# EasyEDA Pro project ProProject_ADS1292R-TestBoard.epro

# Schematic ADS1292R
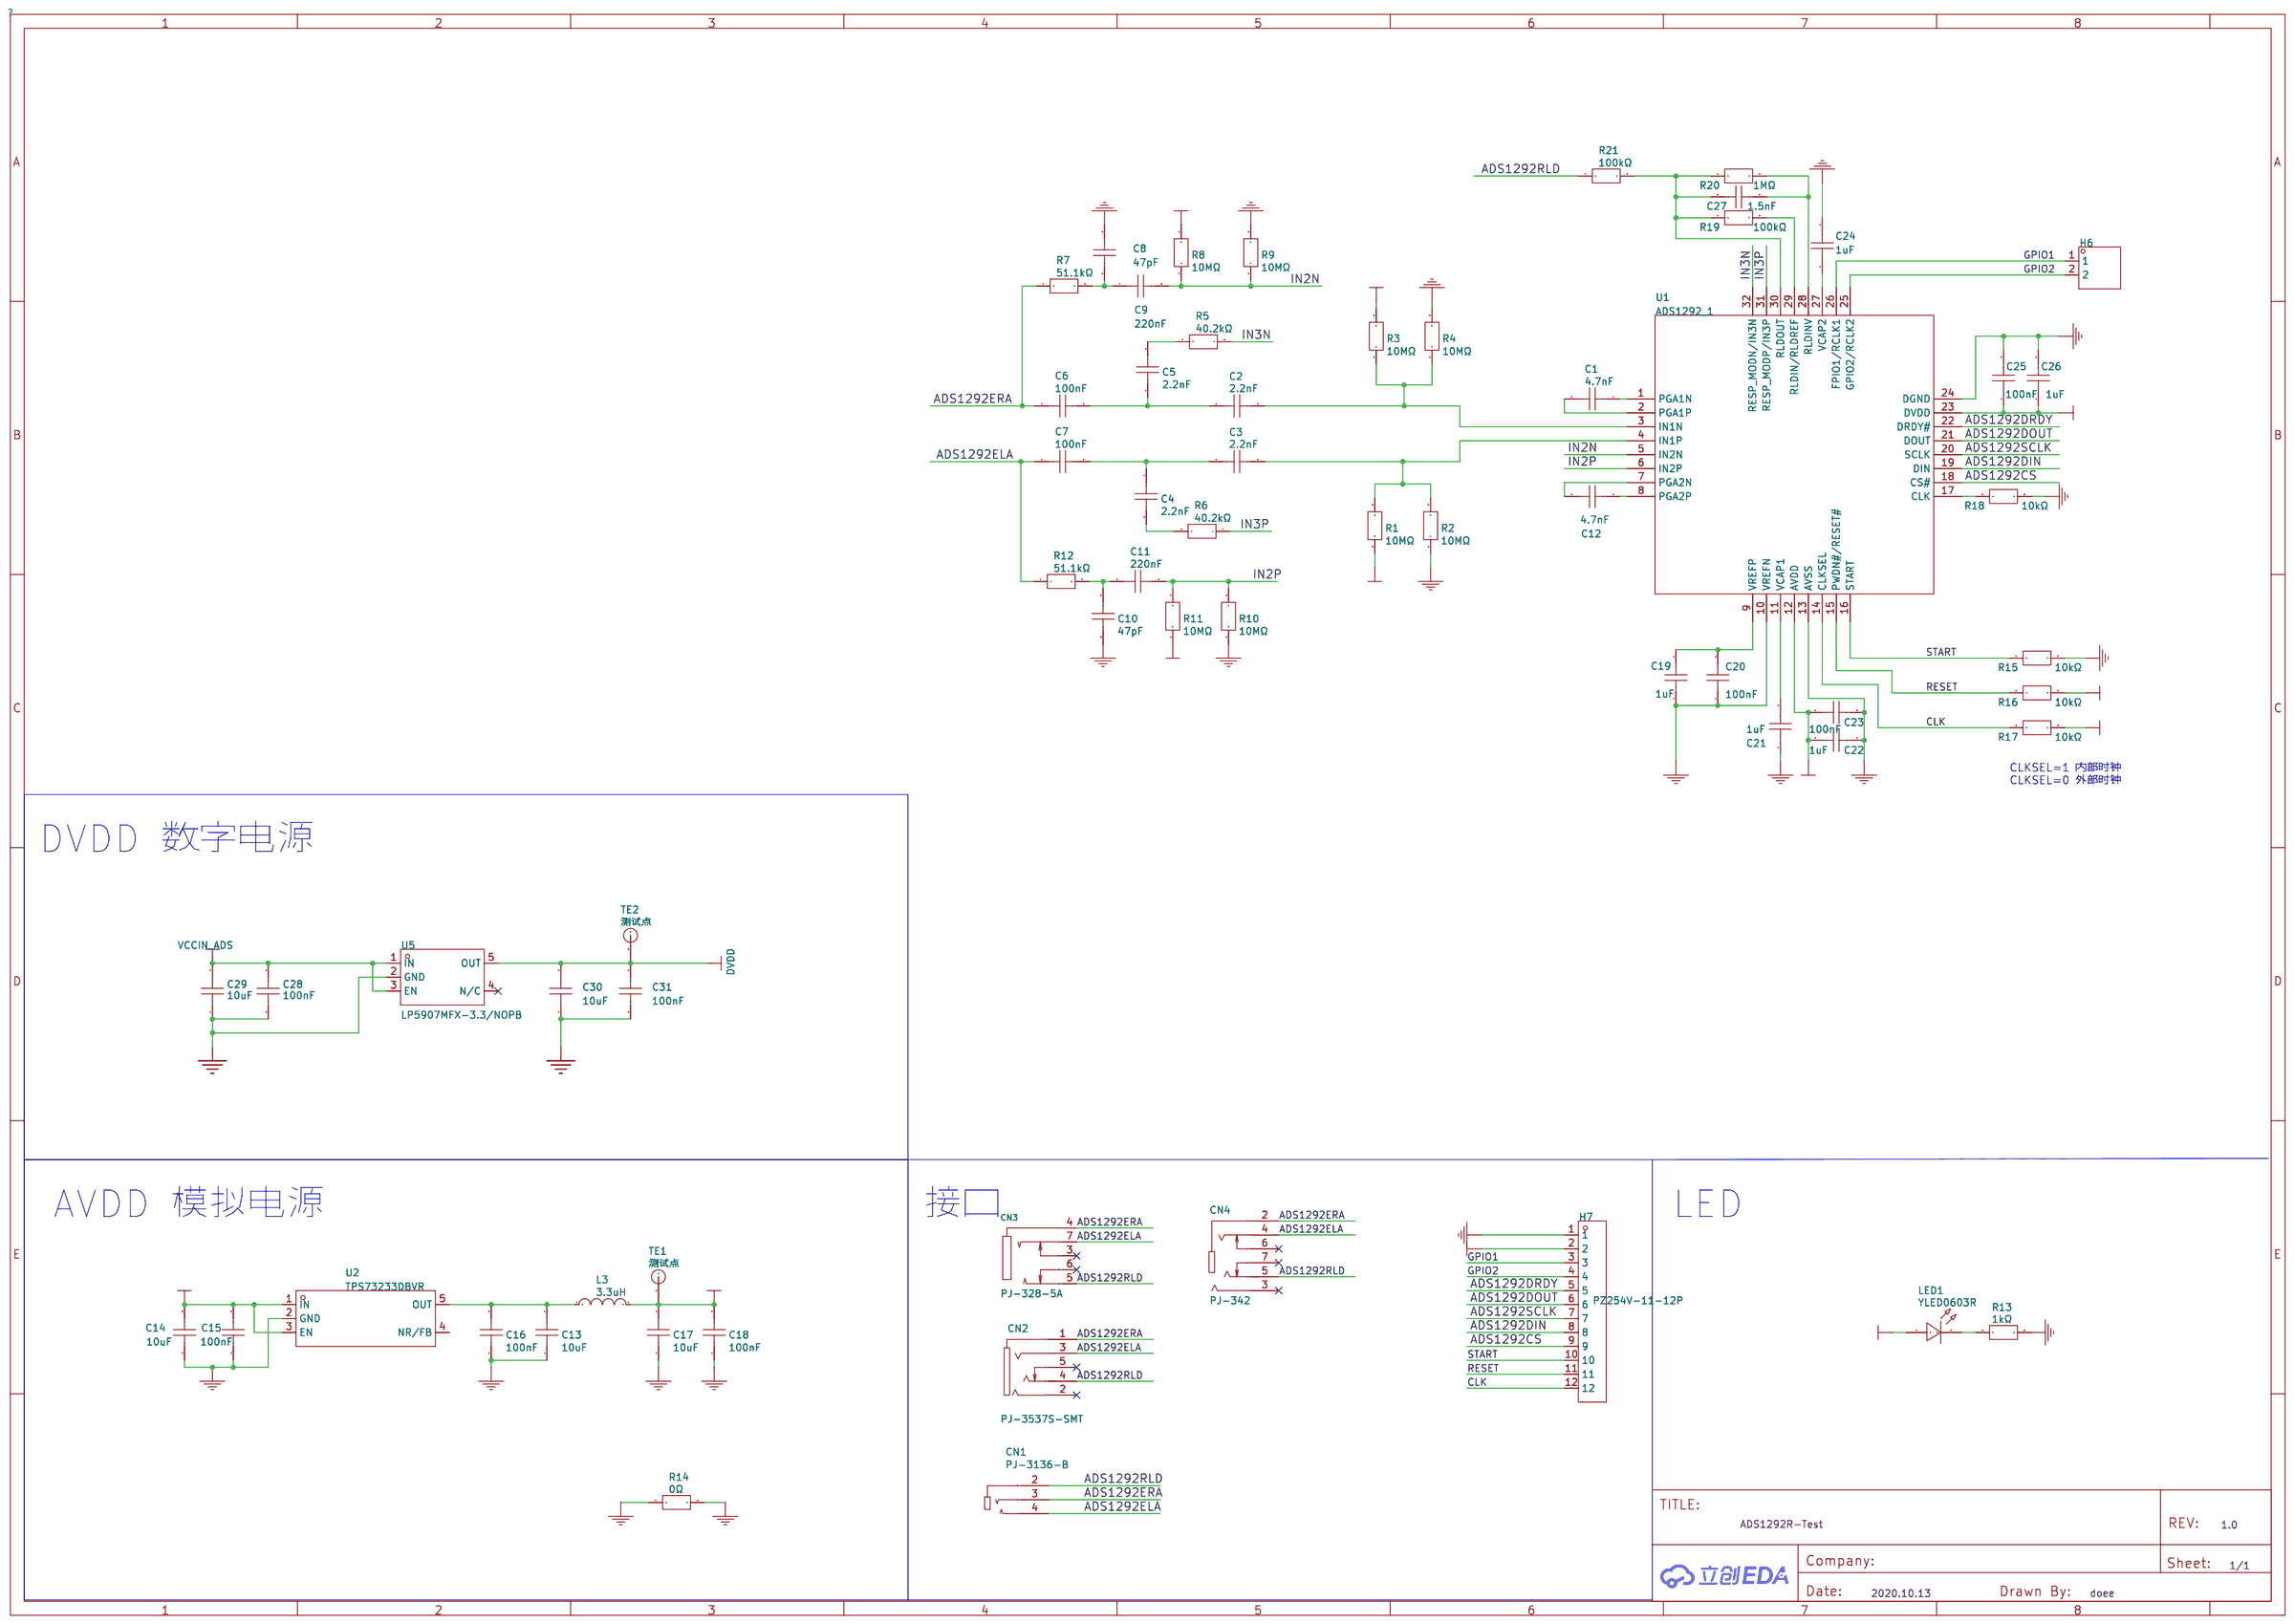
[diagram p0: schematic sheet]

## Parts
C1  4.7nF  [C0603]
C2  2.2nF  [C0603]
C3  2.2nF  [C0603]
C4  2.2nF  [C0603]
C5  2.2nF  [C0603]
C6  100nF  [C0603]
C7  100nF  [C0603]
C8  47pF  [C0603]
C9  220nF  [C0603]
C10  47pF  [C0603]
C11  220nF  [C0603]
C12  4.7nF  [C0603]
C13  10uF  [C0603]
C14  10uF  [C0603]
C15  100nF  [C0603]
C16  100nF  [C0603]
C17  10uF  [C0603]
C18  100nF  [C0603]
C19  1uF  [C0603]
C20  100nF  [C0603]
C21  1uF  [C0603]
C22  1uF  [C0603]
C23  100nF  [C0603]
C24  1uF  [C0603]
C25  100nF  [C0603]
C26  1uF  [C0603]
C27  1.5nF  [C0603]
C28  100nF  [C0603]
C29  10uF  [C0603]
C30  10uF  [C0603]
C31  100nF  [C0603]
CN1  PJ-3136-B  [AUDIO-TH_PJ-3136-B]
CN2  PJ-3537S-SMT  [AUDIO-SMD_PJ-3537S]
CN3  PJ-328-5A  [AUDIO-SMD_PJ-328-5A]
CN4  PJ-342  [AUDIO-SMD_PJ-342]
H6  -  [HDR-TH_2P-P2.54-V-M-1]
H7  PZ254V-11-12P  [HDR-TH_12P-P2.54-V-M]
L3  3.3uH  [L0805]
LED1  YLED0603R  [LED0603_RED]
R1  10MΩ  [R0603]
R2  10MΩ  [R0603]
R3  10MΩ  [R0603]
R4  10MΩ  [R0603]
R5  40.2kΩ  [R0603]
R6  40.2kΩ  [R0603]
R7  51.1kΩ  [R0603]
R8  10MΩ  [R0603]
R9  10MΩ  [R0603]
R10  10MΩ  [R0603]
R11  10MΩ  [R0603]
R12  51.1kΩ  [R0603]
R13  1kΩ  [R0603]
R14  0Ω  [R0603]
R15  10kΩ  [R0603]
R16  10kΩ  [R0603]
R17  10kΩ  [R0603]
R18  10kΩ  [R0603]
R19  100kΩ  [R0603]
R20  1MΩ  [R0603]
R21  100kΩ  [R0603]
TE1  测试点  [测试点]
TE2  测试点  [测试点]
U1  ADS1292_1  [TQFP-32_L5.0-W5.0-P0.50-LS7.0-TL]
U2  TPS73233DBVR  [SOT-23-5_L3.0-W1.7-P0.95-LS2.8-BL]
U5  LP5907MFX-3.3/NOPB  [SOT-23-5_L3.0-W1.7-P0.95-LS2.8-BR]

## Library data of the parts
C1 C12 = CC0603JRX7R9BB472: 容值:4.7nF;精度:±5%;额定电压:50V;材质(温度系数):X7R;; LCSC Part Name: 4.7nF ±5% 50V; Supplier Part: C115060; Manufacturer: YAGEO(国巨); Supplier Footprint: 0603; JLCPCB Part Class: Extended Part; Datasheet: https://atta.szlcsc.com/upload/public/pdf/source/20190902/C115060_75CC56ECD18DDC66370B1FAE6FC3B8B0.pdf; Supplier: LCSC; Tolerance: ±5%; Voltage Rated: 50V; Temperature Coefficient: X7R
C2-C5 = CC0603JRNPO9BN222: 容值:2.2nF;精度:±5%;额定电压:50V;材质(温度系数):NP0;; LCSC Part Name: 2.2nF ±5% 50V; Supplier Part: C107043; Manufacturer: YAGEO(国巨); Supplier Footprint: 0603; JLCPCB Part Class: Extended Part; Datasheet: https://atta.szlcsc.com/upload/public/pdf/source/20170914/C128857_1505359892143968080.pdf; Supplier: LCSC; Tolerance: ±5%; Voltage Rated: 50V; Temperature Coefficient: NP0
C6 C7 C15 C16 C18 C20 C23 C25 C28 C31 = CC0603KRX7R9BB104: 容值:100nF;精度:±10%;额定电压:50V;材质(温度系数):X7R;; LCSC Part Name: 100nF ±10% 50V; Supplier Part: C14663; Manufacturer: YAGEO(国巨); Supplier Footprint: 0603; JLCPCB Part Class: Basic Part; Datasheet: https://atta.szlcsc.com/upload/public/pdf/source/20180910/C282072_33301C7F631E79921B82A8DAC6BCC5B3.pdf; Supplier: LCSC; Tolerance: ±10%; Voltage Rated: 50V; Temperature Coefficient: X7R
C8 C10 = CL10C470JB8NNNC: 容值:47pF;精度:±5%;额定电压:50V;材质(温度系数):C0G;; LCSC Part Name: 47pF ±5% 50V; Supplier Part: C1671; Manufacturer: SAMSUNG(三星); Supplier Footprint: 0603; JLCPCB Part Class: Basic Part; Datasheet: https://atta.szlcsc.com/upload/public/pdf/source/20160218/1457707763339.pdf; Supplier: LCSC; Tolerance: ±5%; Voltage Rated: 50V; Temperature Coefficient: C0G
C9 C11 = CL10B224KA8NNNC: 容值:220nF;精度:±10%;额定电压:25V;材质(温度系数):X7R;; LCSC Part Name: 220nF ±10% 25V; Supplier Part: C21120; Manufacturer: SAMSUNG(三星); Supplier Footprint: 0603; JLCPCB Part Class: Basic Part; Datasheet: https://atta.szlcsc.com/upload/public/pdf/source/20160218/1457707763339.pdf; Supplier: LCSC; Tolerance: ±10%; Voltage Rated: 25V; Temperature Coefficient: X7R
C13 C14 C17 C29 C30 = CL10A106KP8NNNC: 容值:10uF;精度:±10%;额定电压:10V;材质(温度系数):X5R;; LCSC Part Name: 10uF ±10% 10V; Supplier Part: C19702; Manufacturer: SAMSUNG(三星); Supplier Footprint: 0603; JLCPCB Part Class: Basic Part; Datasheet: https://atta.szlcsc.com/upload/public/pdf/source/20160218/1457707763339.pdf; Supplier: LCSC; Tolerance: ±10%; Voltage Rated: 10V; Temperature Coefficient: X5R
C19 C21 C22 C24 C26 = CL10A105KB8NNNC: 容值:1uF;精度:±10%;额定电压:50V;材质(温度系数):X5R;; LCSC Part Name: 1uF ±10% 50V; Supplier Part: C15849; Manufacturer: SAMSUNG(三星); Supplier Footprint: 0603; JLCPCB Part Class: Basic Part; Datasheet: https://atta.szlcsc.com/upload/public/pdf/source/20160218/1457707763339.pdf; Supplier: LCSC; Tolerance: ±10%; Voltage Rated: 50V; Temperature Coefficient: X5R
C27 = 1.5nF: 容值:1.5nF;精度:±10%;额定电压:50V;材质(温度系数):-;; LCSC Part Name: 1.5nF ±10% 50V; Supplier Part: C15723; Manufacturer: SAMSUNG(三星); Supplier Footprint: 0603; JLCPCB Part Class: Extended Part; Datasheet: https://atta.szlcsc.com/upload/public/pdf/source/20160218/1457707763339.pdf; Supplier: LCSC; Tolerance: ±10%; Voltage Rated: 50V
CN1 = PJ-3136-B
CN2 = PJ-3537S-SMT: 连接器类型:3.5mm耳机座;额定电流:500mA;额定电压:30V;工作温度范围:-30℃~+70℃;焊接温度(最大值):235℃;; LCSC Part Name: 3.5mm耳机座; Supplier Part: C2689709; Manufacturer: XKB Connectivity(中国星坤); Supplier Footprint: SMD; JLCPCB Part Class: 扩展库; Datasheet: https://atta.szlcsc.com/upload/public/pdf/source/20211011/4D65D926E465F62F21B1233CD02CC06B.pdf; Supplier: LCSC; Connector Type: 3.5mm耳机座; Current Rating (Max): 500mA; Voltage Rating (Max): 30V; Operating Temperature Range: -30℃~+70℃; Soldering Temperature(Max): 235℃
CN3 = PJ-328-5A: 连接器类型:3.5mm耳机座;额定电流:500mA;额定电压:30V;工作温度范围:-20℃~+70℃;; LCSC Part Name: 3.5mm耳机座; Supplier Part: C707231; Manufacturer: 韩国韩荣; Supplier Footprint: SMD; Datasheet: https://atta.szlcsc.com/upload/public/pdf/source/20210810/0B771907E8D6964D4FE913522096DF4A.pdf; Supplier: LCSC; Connector Type: 3.5mm耳机座; Current Rating (Max): 500mA; Voltage Rating (Max): 30V; Operating Temperature Range: -20℃~+70℃
CN4 = PJ-342_C668606: 连接器类型:3.5mm耳机座;额定电流:500mA;额定电压:30V;工作温度范围:-30℃~+70℃;; LCSC Part Name: 3.5mm耳机座; Supplier Part: C668606; Manufacturer: SHOU HAN(首韩); Supplier Footprint: SMD; Datasheet: https://atta.szlcsc.com/upload/public/pdf/source/20200618/C668606_D9051A7D9D1D8CCDEAA76A8E7BC279ED.pdf; Supplier: LCSC; Connector Type: 3.5mm耳机座; Current Rating (Max): 500mA; Voltage Rating (Max): 30V; Operating Temperature Range: -30℃~+70℃
H6 = HDR-M_2.54_1x2P: Supplier Part: C124375; Supplier Footprint: 插件; JLCPCB Part Class: 扩展库
H7 = PZ254V-11-12P: 插针结构:1x12P;间距:2.54mm;行距:-;圆针/方针:方针;安装类型:直插;排数:单排;总PIN位数:12P;额定电流:3A;额定电压:250V;配合针长度:6mm;塑高:2.5mm;端接针长度:3mm;触头材质:-;工作温度范围:-40℃~+105℃;颜色:黑色;; LCSC Part Name: 间距:2.54mm 1x12P 直插 方针; Supplier Part: C2840012; Manufacturer: XFCN(兴飞); Supplier Footprint: 插件,P=2.54mm; JLCPCB Part Class: Extended Part; Datasheet: https://atta.szlcsc.com/upload/public/pdf/source/20200309/C492403_F9F19131791D08044AD4F84F8E751A34.pdf; Supplier: LCSC; Pin Structure: 1x12P; Pitch: 2.54mm; Circluar Pins/Square Pins: 方针; Mounting Type: 直插; Number of Rows: 单排; Number of Pins: 12P; Current Rating (Max): 3A; Voltage Rating (Max): 250V; Length of Mating Pin: 6mm; Insulation Height: 2.5mm; Length of End Connection Pin: 3mm; Operating Temperature Range: -40℃~+105℃; Color: 黑色
L3 = 3.3uH
LED1 = YLED0603R: 发光颜色:红色;正向电压(VF):1.8V~2.4V;功率:-;正向电流:25mA;主波长:620nm~625nm;二极管配置:-;透镜颜色:-;色温:-;发光强度:-;发光角度:-;载带方式:-;工作温度:-40℃~+85℃;; Supplier Part: C19171390; Manufacturer: YONGYUTAI(永裕泰); Supplier Footprint: 0603; JLCPCB Part Class: Extended Part; Datasheet: https://atta.szlcsc.com/upload/public/pdf/source/20231027/FB19AF06E2C70028E58AB5CEDD1BDC72.pdf; Supplier: LCSC; Emitted Color: 红色; Forward Voltage (VF): 1.8V~2.4V; Forward Current: 25mA; Dominant Wavelength: 620nm~625nm; Operating Temperature: -40℃~+85℃
R1-R4 R8-R11 = 0603WAF1005T5E: 电阻类型:厚膜电阻;阻值:10MΩ;精度:±1%;功率:100mW;最大工作电压:75V;温度系数:±100ppm/℃;; LCSC Part Name: 10MΩ ±1% 100mW 厚膜电阻; Supplier Part: C7250; Manufacturer: UNI-ROYAL(厚声); Supplier Footprint: 0603; JLCPCB Part Class: Basic Part; Datasheet: https://atta.szlcsc.com/upload/public/pdf/source/20200306/C422600_1E6D84923E4A46A82E41ADD87F860B5C.pdf; Supplier: LCSC; Type: 厚膜电阻; Tolerance: ±1%; Power(Watts): 100mW; Overload Voltage (Max): 75V; Temperature Coefficient: ±100ppm/℃; Operating Temperature Range: -55℃~+155℃
R5 R6 = 0603WAF4022T5E: 电阻类型:厚膜电阻;阻值:40.2kΩ;精度:±1%;功率:100mW;最大工作电压:75V;温度系数:±100ppm/℃;; LCSC Part Name: 40.2kΩ ±1% 100mW 厚膜电阻; Supplier Part: C12447; Manufacturer: UNI-ROYAL(厚声); Supplier Footprint: 0603; JLCPCB Part Class: Extended Part; Datasheet: https://atta.szlcsc.com/upload/public/pdf/source/20200306/C422600_1E6D84923E4A46A82E41ADD87F860B5C.pdf; Supplier: LCSC; Type: 厚膜电阻; Tolerance: ±1%; Power(Watts): 100mW; Overload Voltage (Max): 75V; Temperature Coefficient: ±100ppm/℃; Operating Temperature Range: -55℃~+155℃
R7 R12 = 0603WAF5112T5E: 电阻类型:厚膜电阻;阻值:51.1kΩ;精度:±1%;功率:100mW;最大工作电压:75V;温度系数:±100ppm/℃;; LCSC Part Name: 51.1kΩ ±1% 100mW 厚膜电阻; Supplier Part: C23072; Manufacturer: UNI-ROYAL(厚声); Supplier Footprint: 0603; JLCPCB Part Class: Extended Part; Datasheet: https://atta.szlcsc.com/upload/public/pdf/source/20200306/C422600_1E6D84923E4A46A82E41ADD87F860B5C.pdf; Supplier: LCSC; Type: 厚膜电阻; Tolerance: ±1%; Power(Watts): 100mW; Overload Voltage (Max): 75V; Temperature Coefficient: ±100ppm/℃; Operating Temperature Range: -55℃~+155℃
R13 = RC0603FR-071KL: 电阻类型:厚膜电阻;阻值:1kΩ;精度:±1%;功率:100mW;最大工作电压:75V;温度系数:±100ppm/℃;; LCSC Part Name: 厚膜电阻 1kΩ ±1% 100mW; Supplier Part: C22548; Manufacturer: YAGEO(国巨); Supplier Footprint: 0603; JLCPCB Part Class: Extended Part; Datasheet: https://atta.szlcsc.com/upload/public/pdf/source/20180316/70C0E2BDAE7FCC62C531A5A58D202EE1.pdf; Supplier: LCSC; Type: 厚膜电阻; Tolerance: ±1%; Power(Watts): 100mW; Overload Voltage (Max): 75V; Temperature Coefficient: ±100ppm/℃; Operating Temperature Range: -55℃~+155℃
R14 = 0603WAF0000T5E: 电阻类型:厚膜电阻;阻值:0Ω;精度:±1%;功率:100mW;最大工作电压:75V;; LCSC Part Name: 0Ω ±1% 100mW 厚膜电阻; Supplier Part: C21189; Manufacturer: UNI-ROYAL(厚声); Supplier Footprint: 0603; JLCPCB Part Class: Basic Part; Datasheet: https://atta.szlcsc.com/upload/public/pdf/source/20200306/C422600_1E6D84923E4A46A82E41ADD87F860B5C.pdf; Supplier: LCSC; Type: 厚膜电阻; Tolerance: ±1%; Power(Watts): 100mW; Overload Voltage (Max): 75V; Operating Temperature Range: -55℃~+155℃
R15-R18 = 0603WAF1002T5E: 电阻类型:厚膜电阻;阻值:10kΩ;精度:±1%;功率:100mW;最大工作电压:75V;温度系数:±100ppm/℃;; LCSC Part Name: 厚膜电阻 10kΩ ±1% 100mW; Supplier Part: C25804; Manufacturer: UNI-ROYAL(厚声); Supplier Footprint: 0603; JLCPCB Part Class: Basic Part; Datasheet: https://atta.szlcsc.com/upload/public/pdf/source/20200306/C422600_1E6D84923E4A46A82E41ADD87F860B5C.pdf; Supplier: LCSC; Type: 厚膜电阻; Tolerance: ±1%; Power(Watts): 100mW; Overload Voltage (Max): 75V; Temperature Coefficient: ±100ppm/℃; Operating Temperature Range: -55℃~+155℃
R19 R21 = RC0603FR-07100KL: 电阻类型:厚膜电阻;阻值:100kΩ;精度:±1%;功率:100mW;最大工作电压:75V;温度系数:±100ppm/℃;; LCSC Part Name: 厚膜电阻 100kΩ ±1% 100mW; Supplier Part: C14675; Manufacturer: YAGEO(国巨); Supplier Footprint: 0603; JLCPCB Part Class: Extended Part; Datasheet: https://atta.szlcsc.com/upload/public/pdf/source/20140324/1457707028752.pdf; Supplier: LCSC; Type: 厚膜电阻; Tolerance: ±1%; Power(Watts): 100mW; Overload Voltage (Max): 75V; Temperature Coefficient: ±100ppm/℃; Operating Temperature Range: -55℃~+155℃
R20 = 0603WAF1004T5E: 电阻类型:厚膜电阻;阻值:1MΩ;精度:±1%;功率:100mW;最大工作电压:75V;温度系数:±100ppm/℃;; LCSC Part Name: 1MΩ ±1% 100mW 厚膜电阻; Supplier Part: C22935; Manufacturer: UNI-ROYAL(厚声); Supplier Footprint: 0603; JLCPCB Part Class: Basic Part; Datasheet: https://atta.szlcsc.com/upload/public/pdf/source/20200306/C422600_1E6D84923E4A46A82E41ADD87F860B5C.pdf; Supplier: LCSC; Type: 厚膜电阻; Tolerance: ±1%; Power(Watts): 100mW; Overload Voltage (Max): 75V; Temperature Coefficient: ±100ppm/℃; Operating Temperature Range: -55℃~+155℃
TE1 TE2 = 测试点
U1 = ADS1292_1
U2 = TPS73233DBVR: 输出类型:固定;最大输入电压:5.5V;输出电压:3.3V;最大输出电流:250mA;电源纹波抑制比(PSRR):58dB;输出极性:正极;; LCSC Part Name: 输入5.5V 输出3.3V 250mA; Supplier Part: C181459; Manufacturer: TI(德州仪器); Supplier Footprint: SOT-23-5; JLCPCB Part Class: Extended Part; Datasheet: https://www.ti.com/cn/lit/gpn/tps732; Supplier: LCSC; Output Type: 固定; Maximum Input Voltage: 5.5V; Output Voltage: 3.3V; MAX Output Current: 250mA; Power Supply Rejection Ratio (PSRR): 58dB; Dropout Voltage: 150mV@(250mA); standby current: 550uA; Operating Temperature: -40℃~+125℃; Output Polarity: 正极; Number of Outputs: 1
U5 = LP5907MFX-3.3/NOPB: 输出类型:固定;最大输入电压:5.5V;输出电压:3.3V;最大输出电流:250mA;电源纹波抑制比(PSRR):90dB;输出极性:正极;; LCSC Part Name: 输入5.5V 输出3.3V 250mA; Supplier Part: C80670; Manufacturer: TI(德州仪器); Supplier Footprint: SOT-23-5; JLCPCB Part Class: 扩展库; Datasheet: https://www.ti.com/cn/lit/gpn/lp5907; Supplier: LCSC; Output Type: 固定; Maximum Input Voltage: 5.5V; Output Voltage: 3.3V; MAX Output Current: 250mA; Power Supply Rejection Ratio (PSRR): 90dB; Dropout Voltage: 250mV@(250mA); standby current: 25uA; Operating Temperature: -40℃~+125℃; Output Polarity: 正极; Number of Outputs: 1

## Nets
AVDD: C17.2 C18.2 C22.2 C23.2 L3.2 R1.1 R3.2 R8.2 R11.2 TE1.1 U1.12(AVDD)
AVSS: C8.2 C10.2 C18.1 C19.1 C20.1 C22.1 C23.1 R2.1 R4.2 R9.2 R10.2 R14.1 U1.10(VREFN) U1.13(AVSS)
DVDD: C25.1 C26.1 C30.2 C31.2 LED1.1 R16.2 R17.2 TE2.1 U1.23(DVDD) U5.5(OUT)
GND: C13.1 C14.1 C15.1 C16.1 C17.1 C21.1 C24.1 C25.2 C26.2 C28.1 C29.1 C30.1 C31.1 H7.1 R13.2 R14.2 R15.2 R18.2 U1.24(DGND) U2.2(GND) U5.2(GND)
VCCIN_ADS: C14.2 C15.2 C28.2 C29.2 H7.2 U2.1(IN) U2.3(EN) U5.1(IN) U5.3(EN)
ADS1292CS: H7.9 U1.18(CS#)
ADS1292DIN: H7.8 U1.19(DIN)
ADS1292DOUT: H7.6 U1.21(DOUT)
ADS1292DRDY: H7.5 U1.22(DRDY#)
ADS1292ELA: C7.1 CN1.4 CN2.3 CN3.7 CN4.4 R12.1
ADS1292ERA: C6.1 CN1.3 CN2.1 CN3.4 CN4.2 R7.1
ADS1292RLD: CN1.2 CN2.4 CN3.5 CN4.5 R21.1
ADS1292SCLK: H7.7 U1.20(SCLK)
CLK: H7.12 R17.1 U1.14(CLKSEL)
GPIO1: H6.1 H7.3 U1.26(FPIO1/RCLK1)
GPIO2: H6.2 H7.4 U1.25(GPIO2/RCLK2)
IN2N: C9.2 R8.1 R9.1 U1.5(IN2N)
IN2P: C11.2 R10.1 R11.1 U1.6(IN2P)
IN3N: R5.2 U1.32(RESP_MODN/IN3N)
IN3P: R6.1 U1.31(RESP_MODP/IN3P)
RESET: H7.11 R16.1 U1.15(PWDN#/RESET#)
START: H7.10 R15.1 U1.16(START)
$1N1: C1.1 U1.1(PGA1N)
$1N2: C1.2 U1.2(PGA1P)
$1N10: C4.2 R6.2
$1N11: C5.2 R5.1
$1N15: C8.1 C9.1 R7.2
$1N18: C10.1 C11.1 R12.2
$1N28: C12.1 U1.8(PGA2P)
$1N29: C12.2 U1.7(PGA2N)
$1N32: C13.2 C16.2 L3.1 U2.5(OUT)
$1N33: LED1.2 R13.1
$1N42: C19.2 C20.2 U1.9(VREFP)
$1N44: C21.2 U1.11(VCAP1)
$1N51: C24.2 U1.27(VCAP2)
$1N60: R18.1 U1.17(CLK)
$1N67: C27.1 R19.1 R20.1 R21.2 U1.30(RLDOUT)
$1N68: R19.2 U1.29(RLDIN/RLDREF)
$1N69: C27.2 R20.2 U1.28(RLDINV)
$1N6683: C2.1 C5.1 C6.2
$1N6699: C3.1 C4.1 C7.2
$1N6706: C3.2 R1.2 R2.2 U1.4(IN1P)
$1N6736: C2.2 R3.1 R4.1 U1.3(IN1N)

Not connected (* = marked no-connect by the designer): CN2 2* 5*; CN3 3* 6*; CN4 3* 6* 7*; U2 4(NR/FB); U5 4(N/C)*

## Notes on the sheet
- CLKSEL=1 内部时钟
  CLKSEL=0 外部时钟
- DVDD 数字电源
- AVDD 模拟电源
- 接口
- LED

# Board PCB
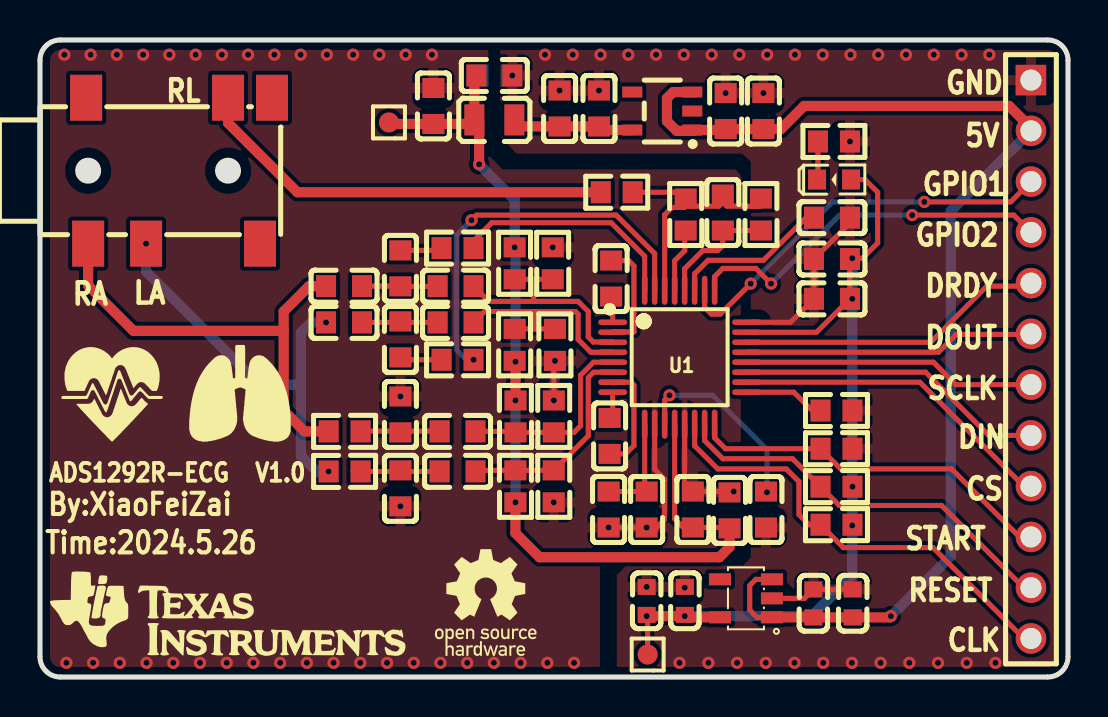
[diagram p1: board, top side]
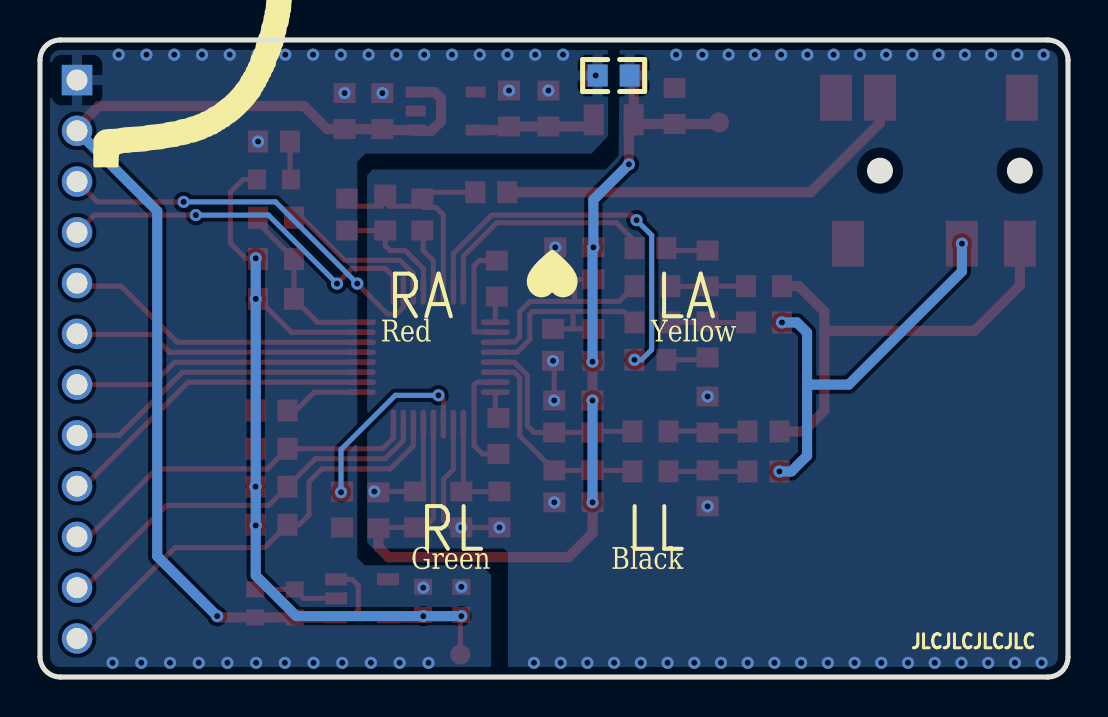
[diagram p2: board, bottom side, seen from below]

Outline 51.43 x 31.88 mm; copper layers: Top Layer, Bottom Layer. Coordinates in mm from the lower left corner of the outline.
Outline path: 0,30.86 0,1.02 arc(0.3,0.3) 1.02,0 50.42,0 arc(51.14,0.3) 51.43,1.02 51.43,30.86 arc(51.14,31.58) 50.42,31.88 1.02,31.88 arc(0.3,31.58) 0,30.86
Stack: Top Layer 0.035mm / Dielectric1 1.51mm FR4 er 4.5 / Bottom Layer 0.035mm

## Design rules (mm)
template: JLCPCB Capability(Two Layers Board)
spacing copperThickness1oz (default): track to track 0.102, other pairs 0.152 to 0.3
spacing copperThickness2oz: track to track 0.203, other pairs 0.152 to 0.3
track width copperThickness1oz (default): min 0.127, default 0.254, max 2.54
track width copperThickness2oz: min 0.203, default 0.254, max 2.54
differential pair differentialPair (default): width min 0.127, default 0.254, max 2.54; gap min 0.152, default 0.152
via viaSize (default): diameter min 0.5, default 0.61, max 10; hole min 0.3, default 0.305, max 6.3

## Placement (name value [footprint] x y rotation side)
C1  4.7nF  [C0603#2]  28.58 19.94 90 top
C2  2.2nF  [C0603#2]  20.79 19.56 0 top
C3  2.2nF  [C0603#2]  20.79 17.74 0 top
C4  2.2nF  [C0603#2]  18.03 16.89 270 top
C5  2.2nF  [C0603#2]  18.03 20.45 90 top
C6  100nF  [C0603#2]  15.21 19.56 0 top
C7  100nF  [C0603#2]  15.21 17.74 0 top
C8  47pF  [C0603#2]  18.03 13.14 90 top
C9  220nF  [C0603#2]  20.89 12.29 0 top
C10  47pF  [C0603#2]  18.03 9.44 270 top
C11  220nF  [C0603#2]  20.89 10.29 0 top
C12  4.7nF  [C0603#2]  28.5 12.07 270 top
C13  10uF  [C0603#2]  27.97 28.45 270 top
C14  10uF  [C0603#2]  34.3 28.32 270 top
C15  100nF  [C0603#2]  36.2 28.32 270 top
C16  100nF  [C0603#2]  26 28.45 270 top
C17  10uF  [C0603#2]  22.73 30.1 180 top
C18  100nF  [C0603#2]  19.68 28.57 270 top
C19  1uF  [C0603#2]  30.35 8.38 90 top
C20  100nF  [C0603#2]  28.45 8.38 90 top
C21  1uF  [C0603#2]  36.32 8.38 90 top
C22  1uF  [C0603#2]  34.5 8.34 270 top
C23  100nF  [C0603#2]  32.66 8.38 270 top
C24  1uF  [C0603#2]  39.62 22.99 180 top
C25  100nF  [C0603#2]  39.62 18.92 180 top
C26  1uF  [C0603#2]  39.62 20.92 180 top
C27  1.5nF  [C0603#2]  34.16 23.24 270 top
C28  100nF  [C0603]  38.69 3.68 270 top
C29  10uF  [C0603]  40.66 3.68 270 top
C30  10uF  [C0603]  32.27 3.81 270 top
C31  100nF  [C0603]  30.35 3.81 270 top
CN4  PJ-342  [AUDIO-SMD_PJ-342]  6.96 25.34 90 top
H7  PZ254V-11-12P  [HDR-TH_12P-P2.54-V-M]  49.58 15.9 270 top
L3  3.3uH  [L0805]  22.73 27.88 180 top
LED1  YLED0603R  [LED0603_RED]  39.73 24.89 180 top
R1  10MΩ  [R0603]  23.75 16.62 90 top
R2  10MΩ  [R0603]  25.76 16.62 90 top
R3  10MΩ  [R0603]  23.75 20.7 90 top
R4  10MΩ  [R0603]  25.65 20.7 90 top
R5  40.2kΩ  [R0603]  20.89 21.46 0 top
R6  40.2kΩ  [R0603]  20.89 15.88 180 top
R7  51.1kΩ  [R0603]  15.24 12.29 0 top
R8  10MΩ  [R0603]  23.79 13.04 90 top
R9  10MΩ  [R0603]  25.71 13.04 90 top
R10  10MΩ  [R0603]  25.7 9.54 270 top
R11  10MΩ  [R0603]  23.79 9.54 270 top
R12  51.1kΩ  [R0603]  15.24 10.29 0 top
R13  1kΩ  [R0603]  39.72 26.8 0 top
R14  0Ω  [R0603]  22.73 30.1 0 bottom
R15  10kΩ  [R0603]  39.85 11.42 0 top
R16  10kΩ  [R0603]  39.85 9.53 0 top
R17  10kΩ  [R0603]  39.85 7.62 0 top
R18  10kΩ  [R0603]  39.85 13.34 0 top
R19  100kΩ  [R0603]  32.3 23.14 270 top
R20  1MΩ  [R0603]  36.07 23.14 270 top
R21  100kΩ  [R0603]  28.86 24.26 0 top
TE1  -  [测试点]  18.16 27.75 0 top
TE2  -  [测试点]  31.1 1.13 0 top
U1  ADS1292_1  [TQFP-32_L5.0-W5.0-P0.50-LS7.0-TL]  32 16 0 top
U2  TPS73233DBVR  [SOT-23-5_L3.0-W1.7-P0.95-LS2.8-BL]  31.13 28.32 90 top
U5  LP5907MFX-3.3/NOPB  [SOT-23-5_L3.0-W1.7-P0.95-LS2.8-BR]  35.32 3.94 0 top

## Footprints (pads in the part's own frame, mm; a bottom-side part is the same pattern mirrored in y, then rotated)
AUDIO-SMD_PJ-342
  rect 2.3x1.6 smd: 2(-3.65,4.55) 3(3.65,4.65) 4(-3.65,1.65) 5(3.65,-2.45) 6(-3.65,-4.05) 7(3.65,-4.65)
C0603
  rect 0.8x0.9 smd: 1(-0.7,0) 2(0.7,0)
C0603#2
  rect 1x1.1 smd: 1(-0.9,0) 2(0.9,0)
HDR-TH_12P-P2.54-V-M
  rect 1.524x1.524 hole 1.05: 1(-13.97,0)
  round 1.524 hole 1.05: 2(-11.43,0) 3(-8.89,0) 4(-6.35,0) 5(-3.81,0) 6(-1.27,0) 7(1.27,0) 8(3.81,0) 9(6.35,0) 10(8.89,0) 11(11.43,0) 12(13.97,0)
L0805
  rect 1x1.55 smd: 1(-1,0) 2(1,0)
LED0603_RED
  rect 0.9x1 smd: 1(-0.85,0) 2(0.85,0)
R0603
  rect 1x1.1 smd: 1(-0.8,0) 2(0.8,0)
SOT-23-5_L3.0-W1.7-P0.95-LS2.8-BL
  rect 0.55x1 smd: 1(-0.95,-1.5) 2(0,-1.5) 3(0.95,-1.5) 4(0.95,1.5) 5(-0.95,1.5)
SOT-23-5_L3.0-W1.7-P0.95-LS2.8-BR
  rect 1.1x0.6 smd: 1(1.3,-0.95) 2(1.3,0) 3(1.3,0.95) 4(-1.3,0.95) 5(-1.3,-0.95)
TQFP-32_L5.0-W5.0-P0.50-LS7.0-TL
  oval 1.45x0.28 smd: 1(-3.35,1.75) 2(-3.35,1.25) 3(-3.35,0.75) 4(-3.35,0.25) 5(-3.35,-0.25) 6(-3.35,-0.75) 7(-3.35,-1.25) 8(-3.35,-1.75) 17(3.35,-1.75) 18(3.35,-1.25) 19(3.35,-0.75) 20(3.35,-0.25) 21(3.35,0.25) 22(3.35,0.75) 23(3.35,1.25) 24(3.35,1.75)
  oval 0.28x1.45 smd: 9(-1.75,-3.35) 10(-1.25,-3.35) 11(-0.75,-3.35) 12(-0.25,-3.35) 13(0.25,-3.35) 14(0.75,-3.35) 15(1.25,-3.35) 16(1.75,-3.35) 25(1.75,3.35) 26(1.25,3.35) 27(0.75,3.35) 28(0.25,3.35) 29(-0.25,3.35) 30(-0.75,3.35) 31(-1.25,3.35) 32(-1.75,3.35)
测试点
  round 1 smd: 1(-0.7,0)

## Nets
As in the schematic.

Pads without a net: CN4 3 6 7; U2 4; U5 4

## Via types
v1: diameter 0.61, hole 0.305, Top Layer to Bottom Layer, 104 vias

## Routing (per net, layer and track width the routed paths; a pad name or vN(x,y) marks a point on that pad's centre or on a via; arc(x,y) is an arc through that point)
AVDD: length 48.4
  Top Layer w0.254: U1.12 31.75,7.92 32.19,7.48 C23.2 34.45,7.48 C22.2 ; v1(23.79,15.78) R1.1
  Top Layer w0.508: v1(23.79,8.74) 23.79,7.2 24.99,5.99 33.99,5.99 34.5,6.5 C22.2 ; 21.84,27.69 21.73,27.8 L3.2 ; L3.2 21.53,27.67 C18.2 17.54,27.67 TE1.1 ; L3.2 21.73,30 C17.2 ; v1(23.79,13.84) v1(23.79,15.78) ; 21.97,27.81 v1(21.97,25.65)
  Bottom Layer w0.508: v1(23.79,15.78) 23.79,21.46 v1(23.75,21.5) 23.75,23.88 v1(21.97,25.65) ; v1(23.79,13.84) 23.79,8.75 v1(23.79,8.74)
AVSS: length 15.6
  Top Layer w0.254: v1(25.71,13.84) 25.71,15.76 v1(25.76,15.82) ; 34.75,9.24 v1(34.71,9.28) 32.64,9.28 32.25,9.67 U1.13 ; v1(28.45,7.48) v1(30.35,7.48) 30.85,7.48 31.24,7.87 31.24,9.91 30.75,10.39 U1.10
  vias: v1(1.22,31.14) v1(1.32,0.71) v1(2.53,31.14) v1(2.66,0.71) v1(3.85,31.14) v1(3.99,0.71) v1(5.16,31.14) v1(5.33,0.71) v1(6.47,31.14) v1(6.67,0.71) v1(7.79,31.14) v1(8,0.71) v1(9.1,31.14) v1(9.34,0.71) v1(10.41,31.14) v1(10.68,0.71) v1(11.73,31.14) v1(12.02,0.71) v1(13.04,31.14) v1(13.35,0.71) v1(14.35,31.14) v1(14.69,0.71) v1(15.67,31.14) v1(16.03,0.71) v1(16.98,31.14) v1(17.36,0.71) v1(18.03,14.04) v1(18.03,8.54) v1(18.3,31.14) v1(18.7,0.71) v1(19.61,31.14) v1(20.04,0.71) v1(21.37,0.71) v1(22.71,0.71) v1(24.05,0.71) v1(25.38,0.71) v1(25.65,21.5) v1(25.7,8.74) v1(26.72,0.71)
DVDD: length 46.3
  Top Layer w0.254: C26.1 C25.1 38.85,17.25 U1.23 ; C31.2 30.4,3.06 TE2.1 ; v1(40.64,20.96) 41.15,20.96 41.91,21.72 41.91,24.26 41.27,24.89 LED1.1
  Top Layer w0.508: U5.5 32.39,2.99 C30.2 32.2,3.05 v1(30.35,3.05)
  Bottom Layer w0.508: v1(40.64,20.96) v1(40.64,18.92) v1(40.64,7.58) 40.64,5.08 38.61,3.05 v1(32.26,3.05) v1(30.35,3.05)
  vias: v1(40.65,9.53)
GND: length 12.9
  Top Layer w0.254: U1.24 37.55,17.75 C25.2 C26.2 40.52,22.72 C24.1 ; C29.1 C28.1 38.25,3.94 U5.2
  vias: v1(23.63,30.1) v1(25.27,31.14) v1(26,29.35) v1(26.66,31.14) v1(28.05,31.14) v1(27.97,29.35) v1(29.43,31.14) v1(30.35,4.51) v1(30.82,31.14) v1(32,0.71) v1(32.21,31.14) v1(32.26,4.47) v1(33.44,0.71) v1(33.6,31.14) v1(34.3,29.22) v1(34.88,0.71) v1(34.99,31.14) v1(36.2,29.22) v1(36.31,0.71) v1(36.38,31.14) v1(37.75,0.71) v1(37.77,31.14) v1(39.16,31.14) v1(39.19,0.71) v1(40.55,31.14) v1(40.52,26.8) v1(40.62,0.71) v1(41.94,31.14) v1(42.06,0.71) v1(43.33,31.14) v1(43.49,0.71) v1(44.72,31.14) v1(44.93,0.71) v1(46.11,31.14) v1(46.37,0.71) v1(47.5,31.14) v1(47.8,0.71)
VCCIN_ADS: length 58.9
  Top Layer w0.254: U5.3 35.82,4.89 35.51,4.58 35.51,3.35 35.87,2.99 U5.1
  Top Layer w0.508: U5.1 36.62,2.98 C28.2 C29.2 42.51,2.98 v1(42.57,3.05) ; 32.7,27.33 31.85,27.33 31.37,27.81 31.37,28.96 31.68,29.27 32.74,29.27 ; 49.63,27.43 48.49,28.58 38.23,28.58 37.07,27.42 C15.2 C14.2 34.26,27.37 32.74,27.37
  Bottom Layer w0.508: v1(42.57,3.05) 45.57,6.05 45.57,23.32 H7.2
ADS1292CS: length 16.4
  Top Layer w0.254: H7.9 49.22,9.55 44.02,14.75 U1.18
ADS1292DIN: length 15.5
  Top Layer w0.254: U1.19 44.31,15.25 47.47,12.09 H7.8
ADS1292DOUT: length 14.6
  Top Layer w0.254: H7.6 49.56,17.15 45.85,17.15 44.95,16.25 U1.21
ADS1292DRDY: length 15.5
  Top Layer w0.254: H7.5 49.43,19.56 47.37,19.56 44.57,16.75 U1.22
ADS1292ELA: length 21.1
  Top Layer w0.254: 14.49,10.47 14.31,10.29
  Bottom Layer w0.508: 13.06,14.63 10.97,14.63 5.31,20.29 v1(5.31,21.69) ; 13.06,14.63 13.06,17.24 13.56,17.74 v1(14.31,17.74) ; 13.06,14.63 13.06,11.07 13.84,10.29 v1(14.44,10.29)
ADS1292ERA: length 23.3
  Top Layer w0.254: 14.62,12.23 14.69,12.3
  Top Layer w0.508: 14.57,12.29 13.24,12.29 12.19,13.34 12.19,17.32 ; 12.19,17.32 4.67,17.32 2.41,19.59 CN4.2 ; 12.19,17.32 12.19,18.29 13.46,19.56 C6.1
ADS1292RLD: length 21.3
  Top Layer w0.508: CN4.5 9.41,27.73 12.88,24.26 R21.1
ADS1292SCLK: length 14.7
  Top Layer w0.254: U1.20 44.7,15.75 45.82,14.63 H7.7
CLK: length 22.4
  Top Layer w0.254: U1.14 32.75,11.57 33.91,10.41 37.34,10.41 37.97,9.78 37.97,8.13 38.48,7.62 R17.1 40.19,6.48 44.68,6.48 49.02,2.13 49.02,1.91
GPIO1: length 20.1
  Top Layer w0.254: U1.26 33.25,18.5 33.59,18.16 34.04,18.16 v1(35.56,19.69) ; H7.3 48.57,23.77 v1(44.25,23.77)
  Bottom Layer w0.254: v1(35.56,19.69) 39.65,23.77 v1(44.25,23.77)
GPIO2: length 18.8
  Top Layer w0.254: v1(36.58,19.69) 35.81,20.45 34.16,20.45 33.75,20.04 U1.25 ; v1(43.64,23.11) 48.72,23.11 H7.4
  Bottom Layer w0.254: v1(36.58,19.69) 40.01,23.11 v1(43.64,23.11)
IN2N: length 9.8
  Top Layer w0.254: C9.2 23.74,12.29 R8.1 R9.1 26.72,12.24 27.05,12.57 27.05,15.11 27.7,15.75 U1.5
IN2P: length 10.6
  Top Layer w0.254: U1.6 27.7,15.25 27.43,14.99 27.43,12.07 R10.1 R11.1 21.84,10.34 C11.2
IN3N: length 11.7
  Top Layer w0.254: R5.2 21.69,21.82 22.6,22.73 28.58,22.73 30.25,21.05 U1.32
IN3P: length 19.8
  Top Layer w0.254: v1(21.59,22.86) 21.84,23.11 28.83,23.11 30.75,21.19 U1.31
  Bottom Layer w0.254: v1(21.59,22.86) 20.83,22.1 20.83,16.38 21.34,15.88 v1(21.69,15.88)
RESET: length 20.2
  Top Layer w0.254: U1.15 33.25,11.83 34.16,10.92 37.65,10.92 R16.1 39.99,8.59 45.11,8.59 49.22,4.47 H7.11
START: length 18
  Top Layer w0.254: 49.02,6.99 45.6,10.41 40.06,10.41 R15.1 34.3,11.42 33.75,11.97 U1.16
$1N1: length 1.3
  Top Layer w0.254: C1.1 28.65,18.96 U1.1
$1N2: length 5.6
  Top Layer w0.254: C1.2 29.45,20.84 29.72,20.57 29.72,17.27 28.67,17.27 U1.2
$1N10: length 2.1
  Top Layer w0.254: C4.2 18.15,15.88 20.07,15.88
$1N11: length 1.9
  Top Layer w0.254: 19.95,21.35 C5.2
$1N15: length 3.8
  Top Layer w0.254: 19.8,12.3 16.04,12.3
$1N18: length 4.1
  Top Layer w0.254: 19.74,10.29 15.66,10.29
$1N28: length 1.4
  Top Layer w0.254: U1.8 28.65,13.14 28.48,12.97
$1N29: length 5.6
  Top Layer w0.254: U1.7 29.57,14.75 29.72,14.61 29.72,11.58 29.3,11.17 28.48,11.17
$1N32: length 6.2
  Top Layer w0.508: 29.74,27.37 28.15,27.37 C13.2 C16.2 24.06,27.55 L3.1
$1N33: length 1.9
  Top Layer w0.254: LED1.2 38.92,24.94 R13.1
$1N42: length 5.3
  Top Layer w0.254: C20.2 C19.2 30.25,9.38 U1.9
$1N44: length 10
  Top Layer w0.254: v1(31.5,14.1) 31.25,13.86 U1.11 ; 36.7,9.28 36.67,9.25 v1(36.37,9.25)
  Bottom Layer w0.254: v1(31.5,14.1) 33.65,14.1 36.37,11.38 v1(36.37,9.25)
$1N51: length 8
  Top Layer w0.254: U1.27 32.75,20.18 33.43,20.85 36.2,20.85 38.35,23 38.71,23 C24.2
$1N60: length 4.1
  Top Layer w0.254: R18.1 38.63,13.34 37.72,14.25 U1.17
$1N67: length 11.7
  Top Layer w0.254: R19.1 31.99,24.26 R21.2 ; U1.30 31.25,23.13 31.62,23.5 32.24,23.5 32.3,23.56 33.96,23.56 34.16,23.76 34.36,23.56 36.07,23.56
$1N68: length 3.2
  Top Layer w0.254: R19.2 32.26,22.3 32.26,21.34 31.75,20.83 U1.29
$1N69: length 6.1
  Top Layer w0.254: 34.16,22.34 34.16,21.59 33.91,21.34 33.16,21.34 32.25,20.43 U1.28 ; 34.16,22.34 R20.2
$1N6683: length 3.7
  Top Layer w0.254: 19.83,19.55 18.03,19.55 18.02,19.56 16.17,19.56
$1N6699: length 3.9
  Top Layer w0.254: 18.08,17.74 C4.1 ; 18.08,17.74 C7.2 ; 18.08,17.74 C3.1
$1N6706: length 11.7
  Top Layer w0.254: U1.4 27.56,16.25 26.92,16.89 26.92,18.16 26.8,18.29 24.76,18.29 ; 24.76,17.42 24.76,18.29 ; 24.76,17.42 R2.2 ; 24.76,17.42 R1.2 ; 24.76,18.29 22.24,18.29 C3.2
$1N6736: length 11.9
  Top Layer w0.254: 25.65,19.9 24.7,19.9 ; 24.7,19.9 R3.1 ; 24.7,19.9 24.7,18.83 24.73,18.8 ; 24.73,18.8 22.45,18.8 C2.2 ; 24.73,18.8 26.92,18.8 27.43,18.29 27.43,17.02 27.69,16.76 28.64,16.76 U1.3

## Copper pours and planes (outline as drawn; the poured copper is in the pictures)
AVSS on Top Layer: 29.05,6.43 28.02,5.44 28.02,-0.08 -0.13,-0.08 -0.13,32.01 22.43,32.01 22.48,26.08 23.13,25.4 34.8,25.4 35.07,25.09 35.07,6.72 34.78,6.43
AVSS on Bottom Layer: 34.8,25.4 35.07,25.09 35.07,6.74 34.78,6.43 28.22,6.43 28.02,6.22 28.02,-0.13 -0.18,-0.13 -0.18,32.01 22.43,32.01 22.48,26.08 23.13,25.4
GND on Top Layer: 29.34,5.59 28.86,5.11 28.86,-0.13 51.56,-0.13 51.56,32.01 23.01,32.01 23.01,27.08 23.84,26.19 35.13,26.19 35.56,25.8 35.56,5.97 35.18,5.59
GND on Bottom Layer: 29.34,5.59 28.86,5.11 28.86,-0.13 51.56,-0.13 51.56,32.01 23.01,32.01 23.01,27.08 23.84,26.19 35.13,26.19 35.56,25.8 35.56,5.97 35.18,5.59

## Text on the board
Bottom Silkscreen Layer: JLCJLCJLCJLC | LA | LL | RL | RA | Yellow | Black | Green | Red
Top Silkscreen Layer: ADS1292R-ECG | V1.0 | Time:2024.5.26 | By:XiaoFeiZai | RA | LA | RL | START | RESET | GPIO2 | GPIO1 | DRDY | DOUT | SCLK | GND | CLK | DIN | 5V | CS
